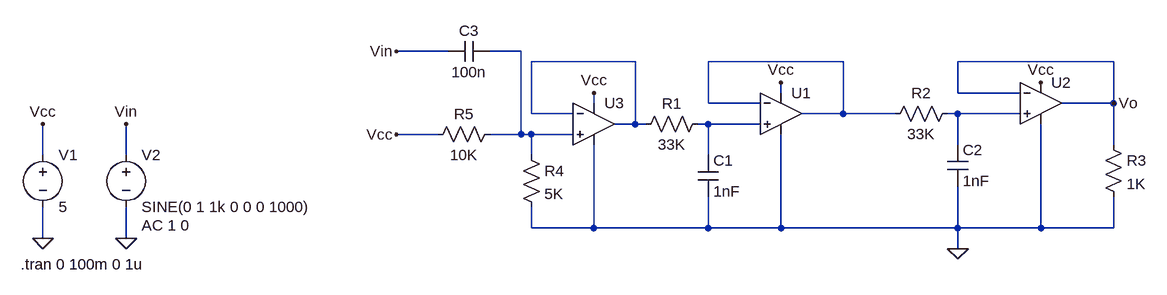
[diagram p0: schematic filtro_aa.asc]
filtro_aa.asc, the LTspice schematic file:
Version 4
SHEET 1 1336 680
WIRE 256 0 176 0
WIRE 368 0 320 0
WIRE 544 16 384 16
WIRE 864 16 656 16
WIRE 1280 16 1040 16
WIRE 768 64 768 48
WIRE 1040 64 1040 16
WIRE 1136 64 1040 64
WIRE 480 80 480 64
WIRE 656 80 656 16
WIRE 736 80 656 80
WIRE 1280 80 1280 16
WIRE 1280 80 1200 80
WIRE 384 96 384 16
WIRE 448 96 384 96
WIRE 864 96 864 16
WIRE 864 96 800 96
WIRE 944 96 864 96
WIRE 1040 96 1024 96
WIRE 1136 96 1040 96
WIRE 544 112 544 16
WIRE 544 112 512 112
WIRE 560 112 544 112
WIRE 656 112 640 112
WIRE 736 112 656 112
WIRE 240 128 176 128
WIRE 368 128 368 0
WIRE 368 128 320 128
WIRE 384 128 368 128
WIRE 448 128 384 128
WIRE 1040 144 1040 96
WIRE 1280 144 1280 80
WIRE -368 160 -368 112
WIRE -240 160 -240 112
WIRE 384 160 384 128
WIRE 656 160 656 112
WIRE 384 272 384 240
WIRE 480 272 480 144
WIRE 480 272 384 272
WIRE 656 272 656 224
WIRE 656 272 480 272
WIRE 768 272 768 128
WIRE 768 272 656 272
WIRE 1040 272 1040 208
WIRE 1040 272 768 272
WIRE 1168 272 1168 112
WIRE 1168 272 1040 272
WIRE 1280 272 1280 224
WIRE 1280 272 1168 272
WIRE -368 288 -368 240
WIRE -240 288 -240 240
WIRE 1040 304 1040 272
FLAG 1040 304 0
FLAG -368 288 0
FLAG -240 288 0
FLAG -368 112 Vcc
FLAG -240 112 Vin
FLAG 768 48 Vcc
FLAG 1168 48 Vcc
FLAG 1280 80 Vo
FLAG 176 128 Vcc
FLAG 176 0 Vin
FLAG 480 64 Vcc
SYMBOL res 656 96 R90
WINDOW 0 0 56 VBottom 2
WINDOW 3 32 56 VTop 2
SYMATTR InstName R1
SYMATTR Value 33K
SYMBOL res 1040 80 R90
WINDOW 0 0 56 VBottom 2
WINDOW 3 32 56 VTop 2
SYMATTR InstName R2
SYMATTR Value 33K
SYMBOL cap 640 160 R0
SYMATTR InstName C1
SYMATTR Value 1nF
SYMBOL cap 1024 144 R0
SYMATTR InstName C2
SYMATTR Value 1nF
SYMBOL res 1264 128 R0
SYMATTR InstName R3
SYMATTR Value 1K
SYMBOL voltage -368 144 R0
WINDOW 123 0 0 Left 2
WINDOW 39 0 0 Left 2
SYMATTR InstName V1
SYMATTR Value 5
SYMBOL voltage -240 144 R0
WINDOW 123 24 124 Left 2
WINDOW 39 0 0 Left 2
SYMATTR InstName V2
SYMATTR Value SINE(0 1 1k 0 0 0 1000)
SYMATTR Value2 AC 1 0
SYMBOL Opamps\\UniversalOpamp2 768 96 R0
SYMATTR InstName U1
SYMATTR Value2 Avol=10Meg GBW=10Meg Slew=10Meg
SYMBOL Opamps\\UniversalOpamp2 1168 80 R0
SYMATTR InstName U2
SYMATTR Value2 Avol=10Meg GBW=10Meg Slew=10Meg
SYMBOL Opamps\\UniversalOpamp2 480 112 R0
SYMATTR InstName U3
SYMATTR Value2 Avol=10Meg GBW=10Meg Slew=10Meg
SYMBOL res 368 144 R0
SYMATTR InstName R4
SYMATTR Value 5K
SYMBOL res 336 112 R90
WINDOW 0 0 56 VBottom 2
WINDOW 3 32 56 VTop 2
SYMATTR InstName R5
SYMATTR Value 10K
SYMBOL cap 320 -16 R90
WINDOW 0 0 32 VBottom 2
WINDOW 3 32 32 VTop 2
SYMATTR InstName C3
SYMATTR Value 100n
TEXT -402 328 Left 2 !.tran 0 100m 0 1u

The netlist it stands for:
* filtro_aa.asc
R1 N005 N002 33K
R2 N004 N003 33K
C1 N005 0 1nF
C2 N004 0 1nF
R3 Vo 0 1K
V1 Vcc 0 5
V2 Vin 0 SINE(0 1 1k 0 0 0 1000) AC 1 0
XU1 N005 N003 Vcc 0 N003 level.2 Avol=10Meg GBW=10Meg Slew=10Meg ilimit=25m rail=0 Vos=0 phimargin=45 en=0 enk=0 in=0 ink=0 Rin=500Meg  ; pins IN+ IN- V+ V- OUT
XU2 N004 Vo Vcc 0 Vo level.2 Avol=10Meg GBW=10Meg Slew=10Meg ilimit=25m rail=0 Vos=0 phimargin=45 en=0 enk=0 in=0 ink=0 Rin=500Meg  ; pins IN+ IN- V+ V- OUT
XU3 N001 N002 Vcc 0 N002 level.2 Avol=10Meg GBW=10Meg Slew=10Meg ilimit=25m rail=0 Vos=0 phimargin=45 en=0 enk=0 in=0 ink=0 Rin=500Meg  ; pins IN+ IN- V+ V- OUT
R4 N001 0 5K
R5 N001 Vcc 10K
C3 N001 Vin 100n
.tran 0 100m 0 1u
.lib UniversalOpamps2.sub
.backanno
.end